# EAGLE design PET_Diag_KB (EAGLE 9.5.2)
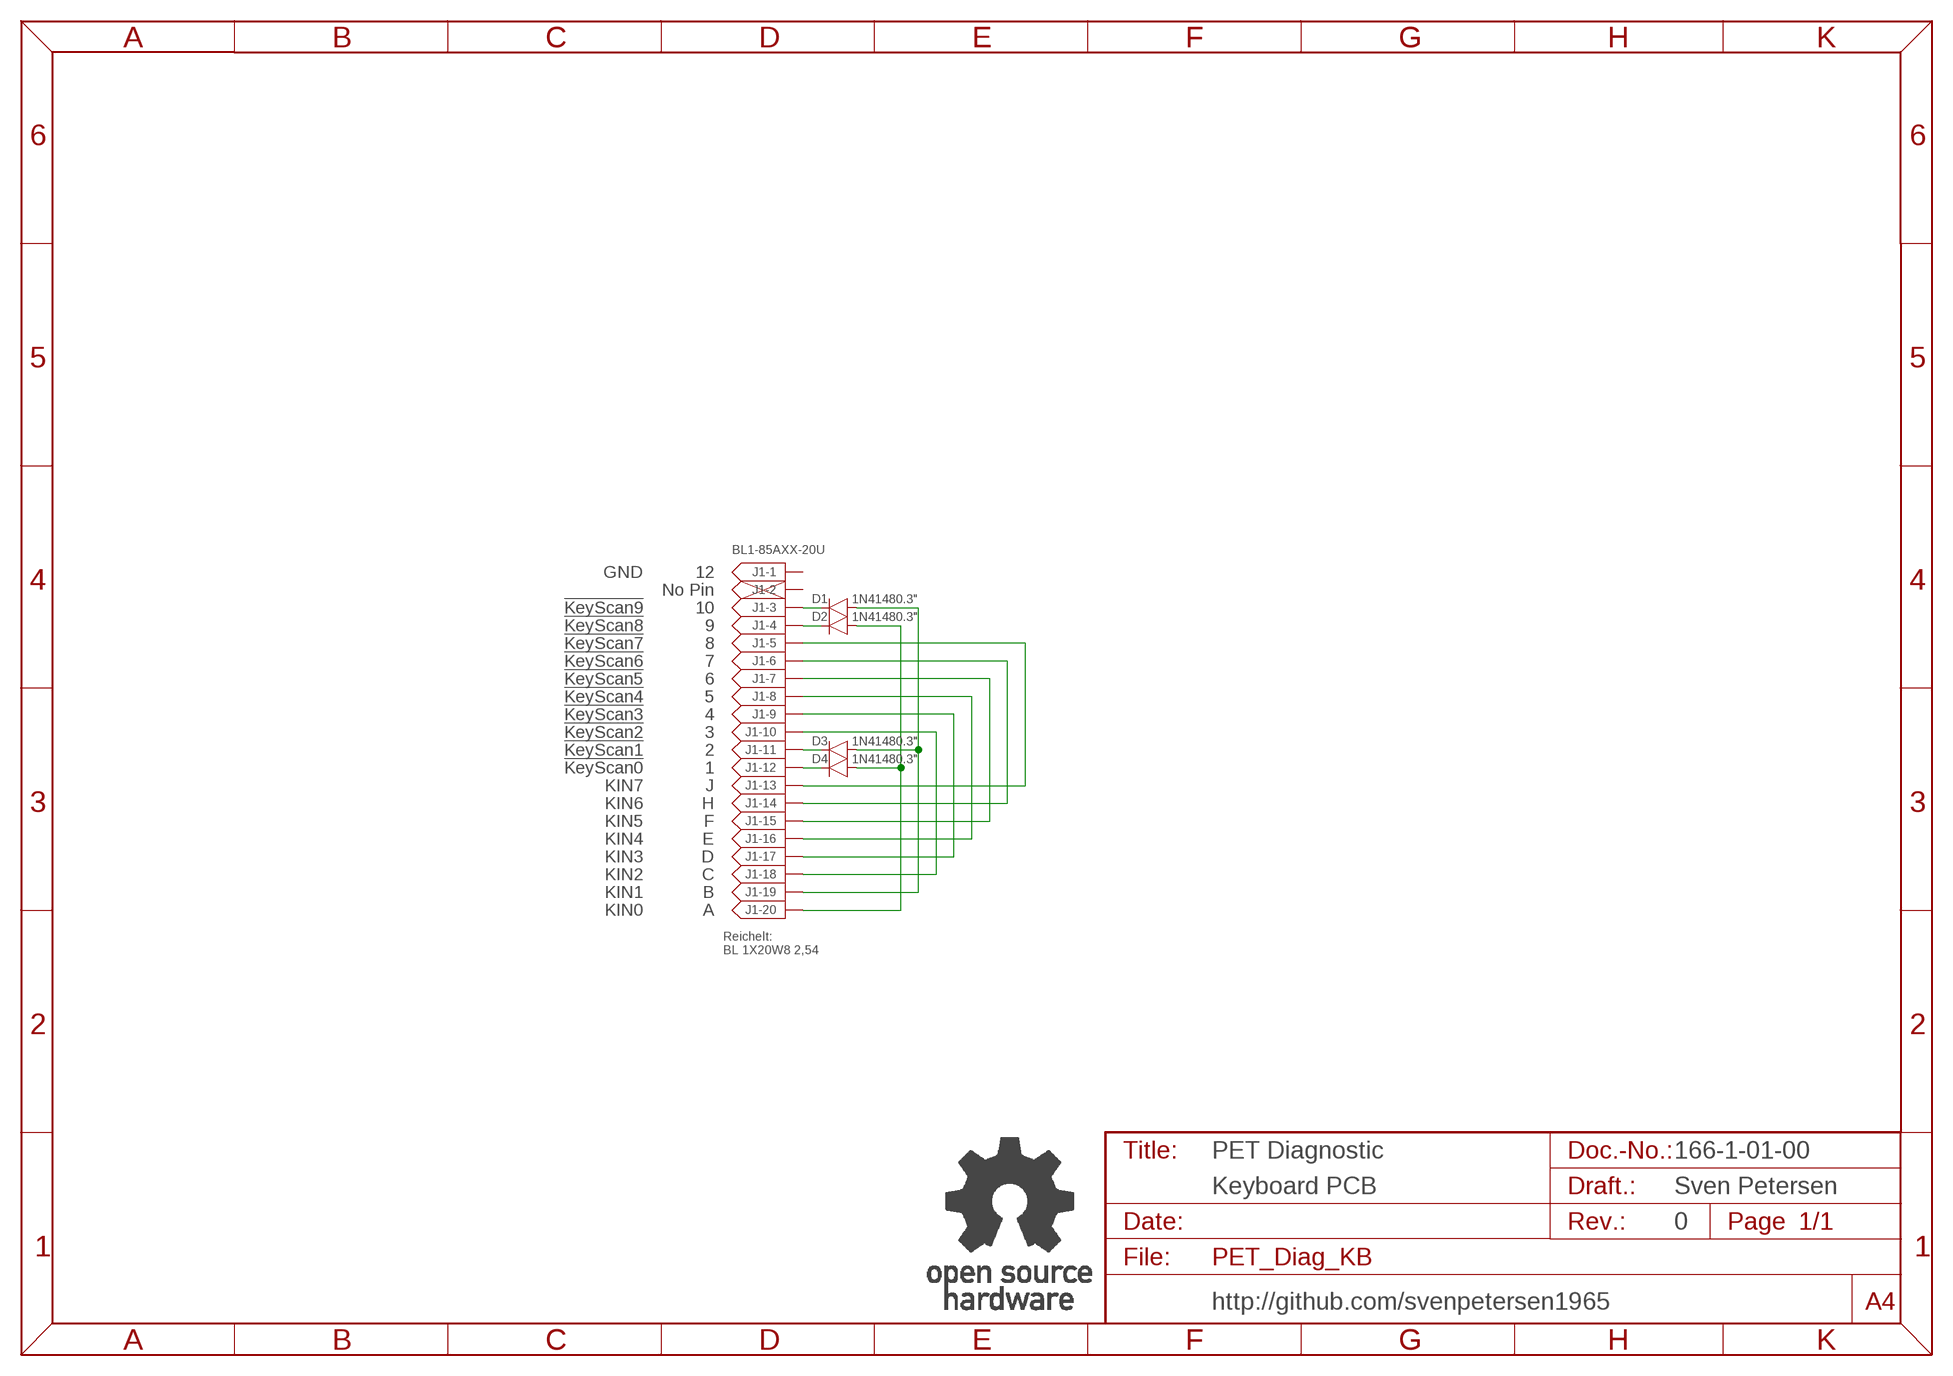
[diagram p0: schematic, sheet 1]

## Parts
D1  1N41480.3"  [DO-35/3]
D2  1N41480.3"  [DO-35/3]
D3  1N41480.3"  [DO-35/3]
D4  1N41480.3"  [DO-35/3]
J1  BL1-85AXX-20U  [BL1-85AXX-20U]
U$9  OPEN_SOURCE_HW  [OPENHW]

## Nets
N$1: D1.K J1.3
N$2: D2.A D4.A J1.20
N$3: D1.A D3.A J1.19
N$4: J1.10 J1.18
N$5: J1.9 J1.17
N$6: J1.8 J1.16
N$7: J1.7 J1.15
N$8: J1.6 J1.14
N$9: J1.5 J1.13
N$10: D2.K J1.4
N$11: D3.K J1.11
N$12: D4.K J1.12
Unconnected: J1.1 J1.2

## Notes on the sheet
- GND | 12
- No Pin
- !KeyScan9 | 10
- !KeyScan8 | 9
- !KeyScan7 | 8
- !KeyScan6 | 7
- !KeyScan5 | 6
- !KeyScan4 | 5
- !KeyScan3 | 4
- !KeyScan2 | 3
- !KeyScan1 | 2
- !KeyScan0 | 1
- KIN7 | J
- KIN6 | H
- KIN5 | F
- KIN4 | E
- KIN3 | D
- KIN2 | C
- KIN1 | B
- KIN0 | A
- Reichelt:
  BL 1X20W8 2,54
- PET Diagnostic | 166-1-01-00
- Keyboard PCB | Sven Petersen
- 0
- http://github.com/svenpetersen1965

## Library data of the parts
D1-D4 = Dioden:1N4148
J1 = MPE_Garry:BL1-85AXX-20U
U$9 = Logo:OPEN_SOURCE_HW

## Board
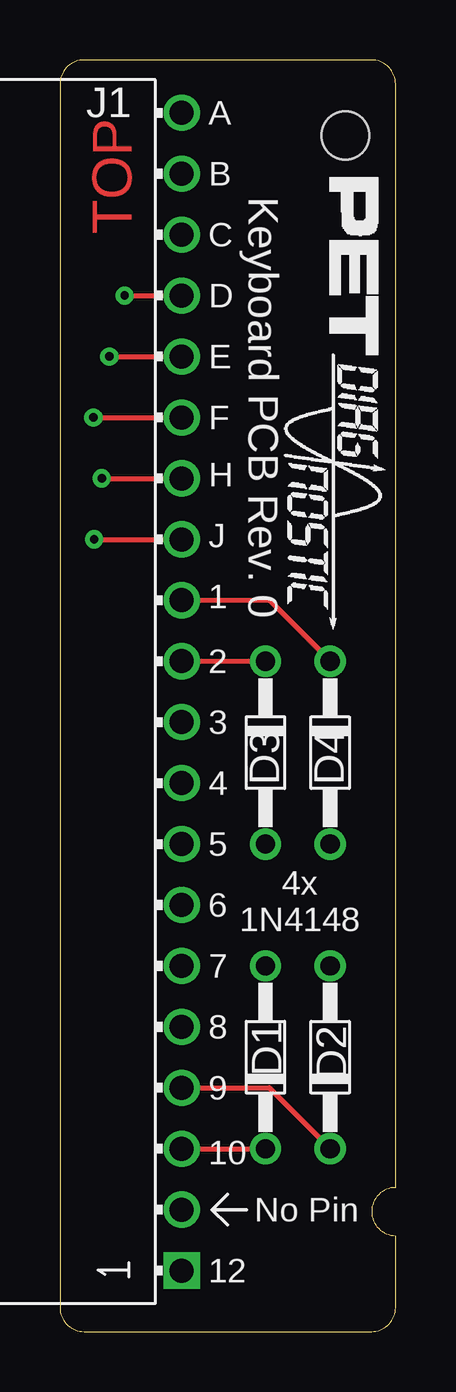
[diagram p1: board, top side]
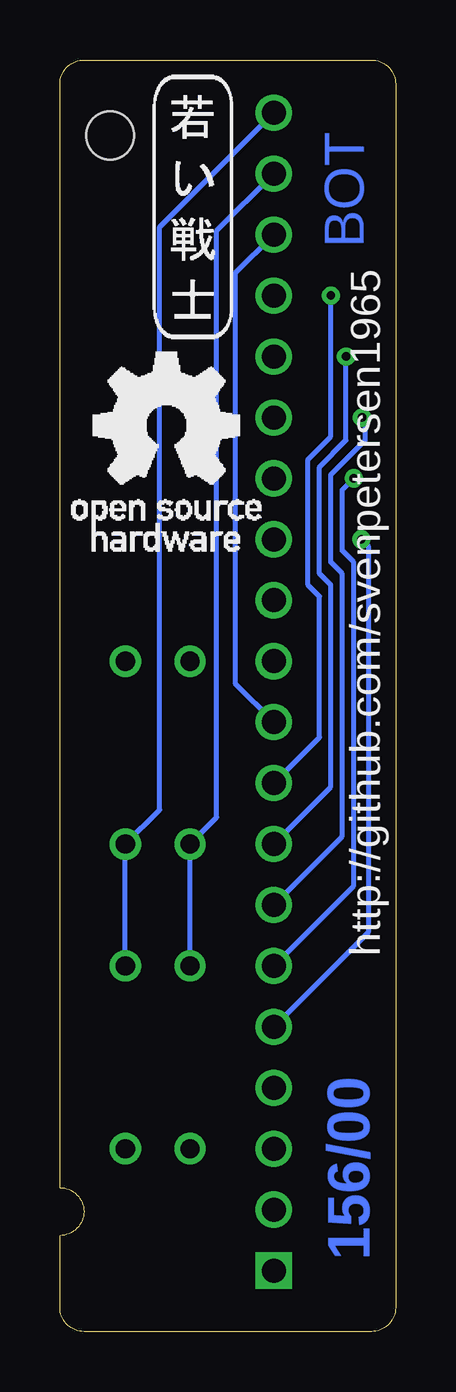
[diagram p2: board, bottom side, seen from below]

Size 14 x 53 mm. Coordinates in mm from the lower left corner, seen from the top.
Outline: 14,6 14,52 arc90 13,53 1,53 arc90 0,52 0,1 arc90 1,0 13,0 arc90 14,1 14,4 arc-180 14,6
Copper layers (1*16): Top 0.035mm / dielectric 1.5mm / Bottom 0.035mm
Design rules "default *": minimum track width 6mil, minimum drill 0.35mm, track to track 6mil, track to pad 6mil, pad to pad 6mil, via to via 6mil, smd to smd 6mil, copper to edge 40mil, drill to drill 6mil, minimum pad ring 10mil, minimum via ring 8mil, stop-mask expansion 4mil, vias tented up to drill 24mil, thermal gap 10mil
Holes 2 mm at 11.91,49.85

### Footprints (pad centres in the part's own frame; a part is rotated, then mirrored left to right if it is on the bottom)
DO-35/3 = drill 0.8: A -3.81,0; K 3.81,0
BL1-85AXX-20U = drill 1 square: 1 -24.13,0 | drill 1: 2 -21.59,0; 3 -19.05,0; 4 -16.51,0; 5 -13.97,0; 6 -11.43,0; 7 -8.89,0; 8 -6.35,0; 9 -3.81,0; 10 -1.27,0; 11 1.27,0; 12 3.81,0; 13 6.35,0; 14 8.89,0; 15 11.43,0; 16 13.97,0; 17 16.51,0; 18 19.05,0; 19 21.59,0; 20 24.13,0

### Placement (x,y rotation side)
D1  8.57,11.43 270 top
D2  11.27,11.43 270 top
D3  8.57,24.13 90 top
D4  11.27,24.13 90 top
J1  5.08,26.67 90 top
U$2  [DIAG_SMALL]  9.37,40.8 270 top
U$3  [PET_SMALL]  11.27,48.1 270 top
U$6  [2LAYER]  2.99,45.73 90 top
U$7  [PCB-TITLE/]  0,60 0 top  (outside the outline)
U$8  [SVEN_TAG]  8.41,46.99 0 bottom
U$9  13.49,32.54 0 bottom

### Tracks (layer width: path | path; a pad name or v marks a point on that pad's centre or on a via)
N$1
  Top 0.203: J1.3 D1.K
N$2
  Bottom 0.203: D2.A D4.A 9.84,21.75 9.84,46.04 J1.20
N$3
  Bottom 0.203: D1.A D3.A 7.46,21.43 7.46,45.88 J1.19
N$4
  Bottom 0.203: J1.10 6.67,26.99 6.67,44.13 J1.18
N$5  (via drill 0.35)
  Top 0.203: v2.7,43.18 J1.17
  Bottom 0.203: J1.9 3.17,24.77 3.17,30.64 3.65,31.11 3.65,36.35 2.7,37.31 v2.7,43.18
N$6  (via drill 0.35)
  Top 0.203: v2.06,40.64 J1.16
  Bottom 0.203: J1.8 2.7,22.7 2.7,31.11 3.17,31.59 3.17,36.04 2.06,37.15 v2.06,40.64
N$7  (via drill 0.35)
  Top 0.203: v1.39,38.1 J1.15
  Bottom 0.203: J1.7 2.22,20.64 2.22,31.59 2.7,32.07 2.7,35.72 1.27,37.15 1.27,38.1 v1.39,38.1
N$8  (via drill 0.35)
  Top 0.203: v1.75,35.56 J1.14
  Bottom 0.203: J1.6 1.75,18.57 1.75,32.07 2.22,32.54 2.22,35.08 v1.75,35.56
N$9  (via drill 0.35)
  Top 0.203: v1.43,33.02 J1.13
  Bottom 0.203: J1.5 1.12,16.66 1.12,32.71 v1.43,33.02
N$10
  Top 0.203: J1.4 8.73,10.16 D2.K
N$11
  Top 0.203: J1.11 D3.K
N$12
  Top 0.203: J1.12 8.73,30.48 D4.K

### Text on the board
Bottom: 156/00
tPlace: A | B | Keyboard PCB Rev. 0 | C | D | E | F | H | J | 1 | 2 | 3 | 4 | 5 | 6 | 4x / 1N4148 | 7 | 8 | 9 | 10 | No Pin | 12
bPlace: http://github.com/svenpetersen1965
Document: 166-2-01-00 | Sven Petersen / 2020 | 35µm | 2 | 0